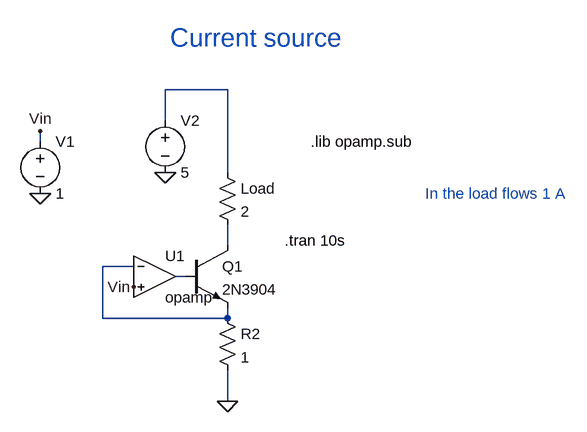
[diagram p0: schematic Current-source-BJT.asc]
Current-source-BJT.asc, the LTspice schematic file:
Version 4
SHEET 1 1704 680
WIRE 272 -64 176 -64
WIRE 176 -16 176 -64
WIRE -16 16 -16 0
WIRE 272 64 272 -64
WIRE 272 176 272 144
WIRE 128 208 80 208
WIRE 208 224 192 224
WIRE 80 288 80 208
WIRE 272 288 272 272
WIRE 272 288 80 288
WIRE 272 416 272 368
FLAG -16 0 Vin
FLAG -16 96 0
FLAG 272 416 0
FLAG 128 240 Vin
FLAG 176 64 0
SYMBOL voltage -16 0 R0
WINDOW 123 0 0 Left 2
WINDOW 39 0 0 Left 2
SYMATTR InstName V1
SYMATTR Value 1
SYMBOL res 256 48 R0
SYMATTR InstName Load
SYMATTR Value 2
SYMBOL npn 208 176 R0
SYMATTR InstName Q1
SYMATTR Value 2N3904
SYMBOL res 256 272 R0
SYMATTR InstName R2
SYMATTR Value 1
SYMBOL Opamps\\opamp 160 160 R0
SYMATTR InstName U1
SYMBOL voltage 176 -32 R0
WINDOW 123 0 0 Left 2
WINDOW 39 0 0 Left 2
SYMATTR InstName V2
SYMATTR Value 5
TEXT 360 168 Left 2 !.tran 10s
TEXT 400 16 Left 2 !.lib opamp.sub
TEXT 576 96 Left 2 ;In the load flows 1 A
TEXT 184 -144 Left 4 ;Current source

The netlist it stands for:
* Current-source-BJT.asc
V1 Vin 0 1
R§Load N001 N002 2
Q1 N002 N004 N003 0 2N3904
R2 N003 0 1
XU1 N003 Vin N004 opamp Aol=100K GBW=10Meg  ; pins invin noninvin out
V2 N001 0 5
.model NPN NPN
.model PNP PNP
.lib standard.bjt
.tran 10s
.lib opamp.sub
* In the load flows 1 A
* Current source
.backanno
.end